# EAGLE design ODR_override rev 1a (EAGLE 7.5.0)
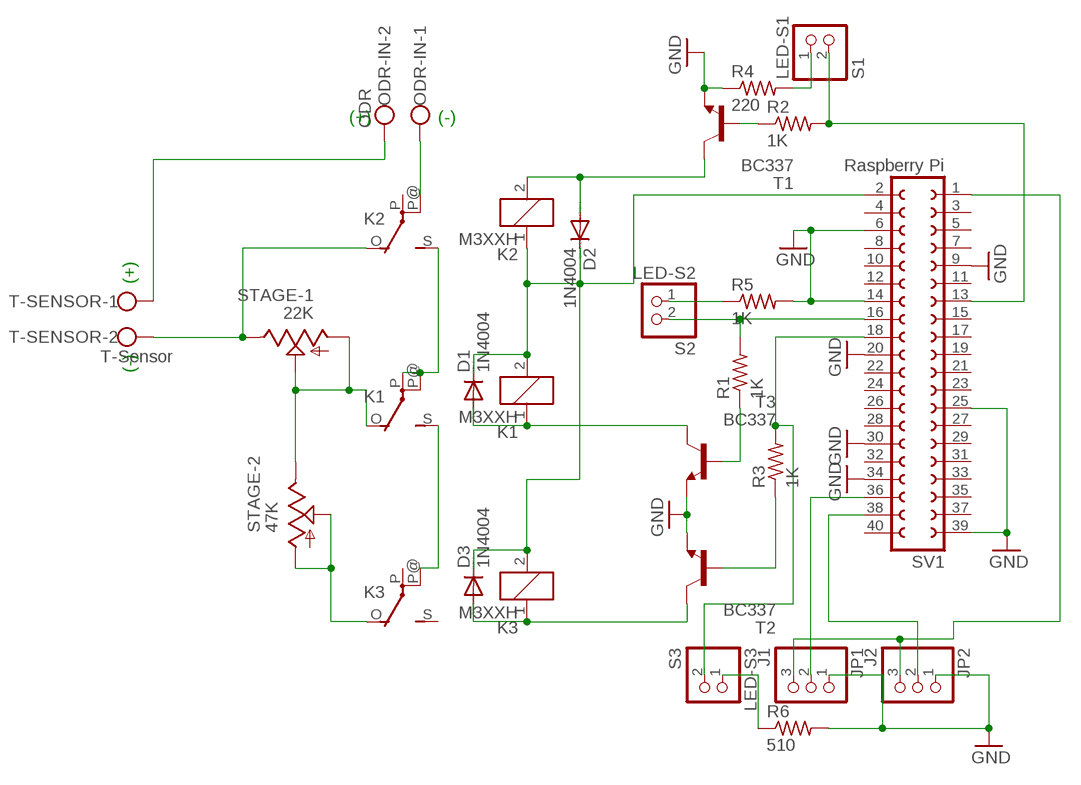
[diagram p0: schematic, sheet 1]

## Parts
D1  1N4004  [DO41-10]
D2  1N4004  [DO41-10]
D3  1N4004  [DO41-10]
JP1  J1  PINHD-1X3  [1X03]
JP2  J2  PINHD-1X3  [1X03]
K1  M3XXH  [M3XXH]
K2  M3XXH  [M3XXH]
K3  M3XXH  [M3XXH]
LED-S1  S1  PINHD-1X2  [1X02]
LED-S2  S2  PINHD-1X2  [1X02]
LED-S3  S3  PINHD-1X2  [1X02]
ODR-IN  ODR  W237-102  [W237-102]
R1  1K  R-US_0204/7  [0204/7]
R2  1K  R-US_0204/7  [0204/7]
R3  1K  R-US_0204/7  [0204/7]
R4  220  R-US_0204/7  [0204/7]
R5  1K  R-US_0204/7  [0204/7]
R6  510  R-US_0204/7  [0204/7]
STAGE-1  22K  TRIM_US-B25P  [B25P]
STAGE-2  47K  TRIM_US-B25P  [B25P]
SV1  Raspberry Pi  FE20-2  [FE20-2]
T1  BC337  [TO92]
T2  BC337  [TO92]
T3  BC337  [TO92]
T-SENSOR  T-Sensor  W237-102  [W237-102]

## Nets
GND: JP1.1 JP2.1 R4.1 R5.2 R6.2 SV1.6 SV1.9 SV1.14 SV1.20 SV1.25 SV1.30 SV1.34 SV1.39 T1.1(E) T2.1(E) T3.1(E)
N$1: D1.A K1.1 T3.3(C)
N$2: LED-S1.2 R2.2 SV1.13
N$3: K1.S(2:S) K3.P@(2:P)
N$4: K2.P@(2:P) ODR-IN.1
N$5: LED-S3.2 R3.2 SV1.18
N$6: D3.A K3.1 T2.3(C)
N$7: ODR-IN.2 T-SENSOR.1
N$8: K1.O(2:O) STAGE-1.A STAGE-1.S STAGE-2.E
N$9: D2.A K2.2 T1.3(C)
N$10: R2.1 T1.2(B)
N$11: JP1.3 JP2.3 SV1.1
N$12: LED-S2.2 R1.2 SV1.16
N$13: R3.1 T2.2(B)
N$14: R1.1 T3.2(B)
N$15: K2.O(2:O) STAGE-1.E T-SENSOR.2
N$16: K1.P(2:P) K1.P@(2:P) K2.S(2:S)
N$17: K3.O(2:O) STAGE-2.A STAGE-2.S
N$18: JP1.2 SV1.36
N$19: JP2.2 SV1.38
N$20: LED-S1.1 R4.2
N$21: LED-S2.1 R5.1
N$22: LED-S3.1 R6.1
VCC: D1.C D2.C D3.C K1.2 K2.1 K3.2 SV1.2
Unconnected: K2.P(2:P) K3.P(2:P) K3.S(2:S) SV1.3 SV1.4 SV1.5 SV1.7 SV1.8 SV1.10 SV1.11 SV1.12 SV1.15 SV1.17 SV1.19 SV1.21 SV1.22 SV1.23 SV1.24 SV1.26 SV1.27 SV1.28 SV1.29 SV1.31 SV1.32 SV1.33 SV1.35 SV1.37 SV1.40

## Notes on the sheet
- (+) | (-)
- (+)
- (-)

## Library data of the parts
D1-D3 = diode:1N4004: DIODE general purpose rectifier, 1 A
JP1 JP2 = pinhead:PINHD-1X3: PIN HEADER
K1-K3 = relay:M3XXH: RELAY 1 x switch; OC_FARNELL: unknown; OC_NEWARK: unknown
LED-S1-LED-S3 = pinhead:PINHD-1X2: PIN HEADER
ODR-IN T-SENSOR = con-wago-500:W237-102: WAGO SCREW CLAMP; MPN: 237-102; OC_FARNELL: unknown; OC_NEWARK: 70K9898
R1-R6 = resistor:R-US_: RESISTOR, American symbol
STAGE-1 STAGE-2 = pot:TRIM_US-: POTENTIOMETER
SV1 = con-lsta:FE20-2: FEMALE HEADER; OC_FARNELL: unknown; OC_NEWARK: unknown
T1-T3 = transistor:BC337: NPN TRANSISTOR

## Board
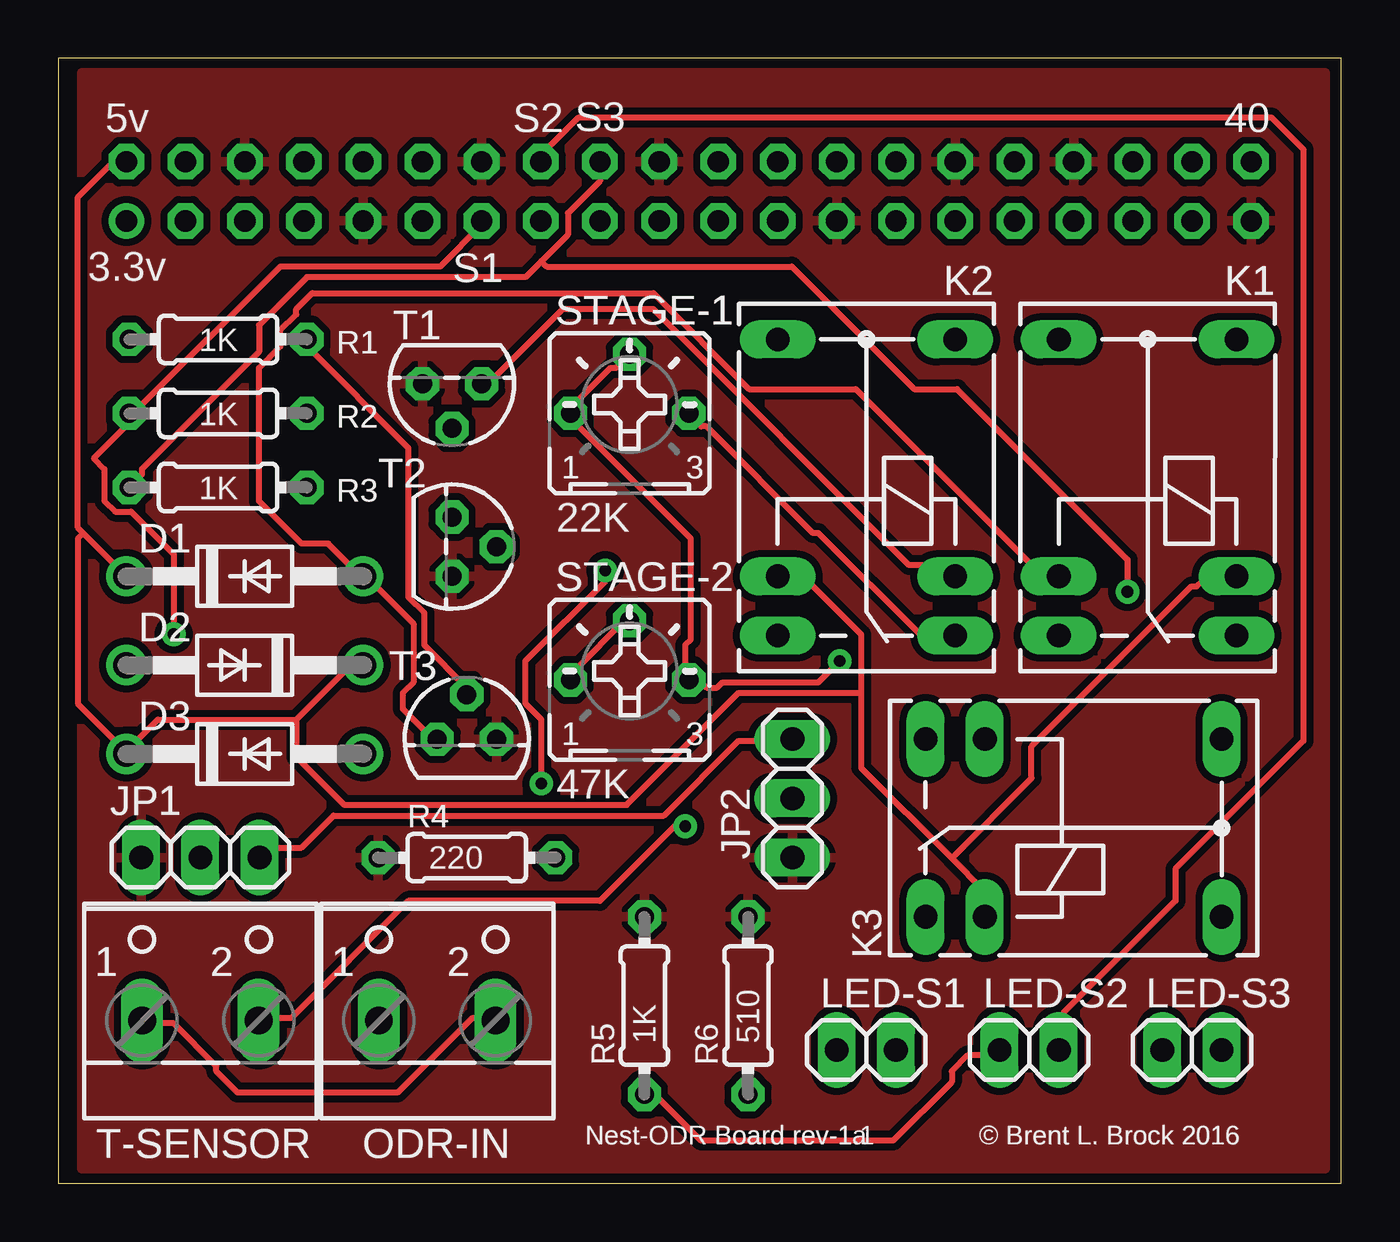
[diagram p1: board, top side]
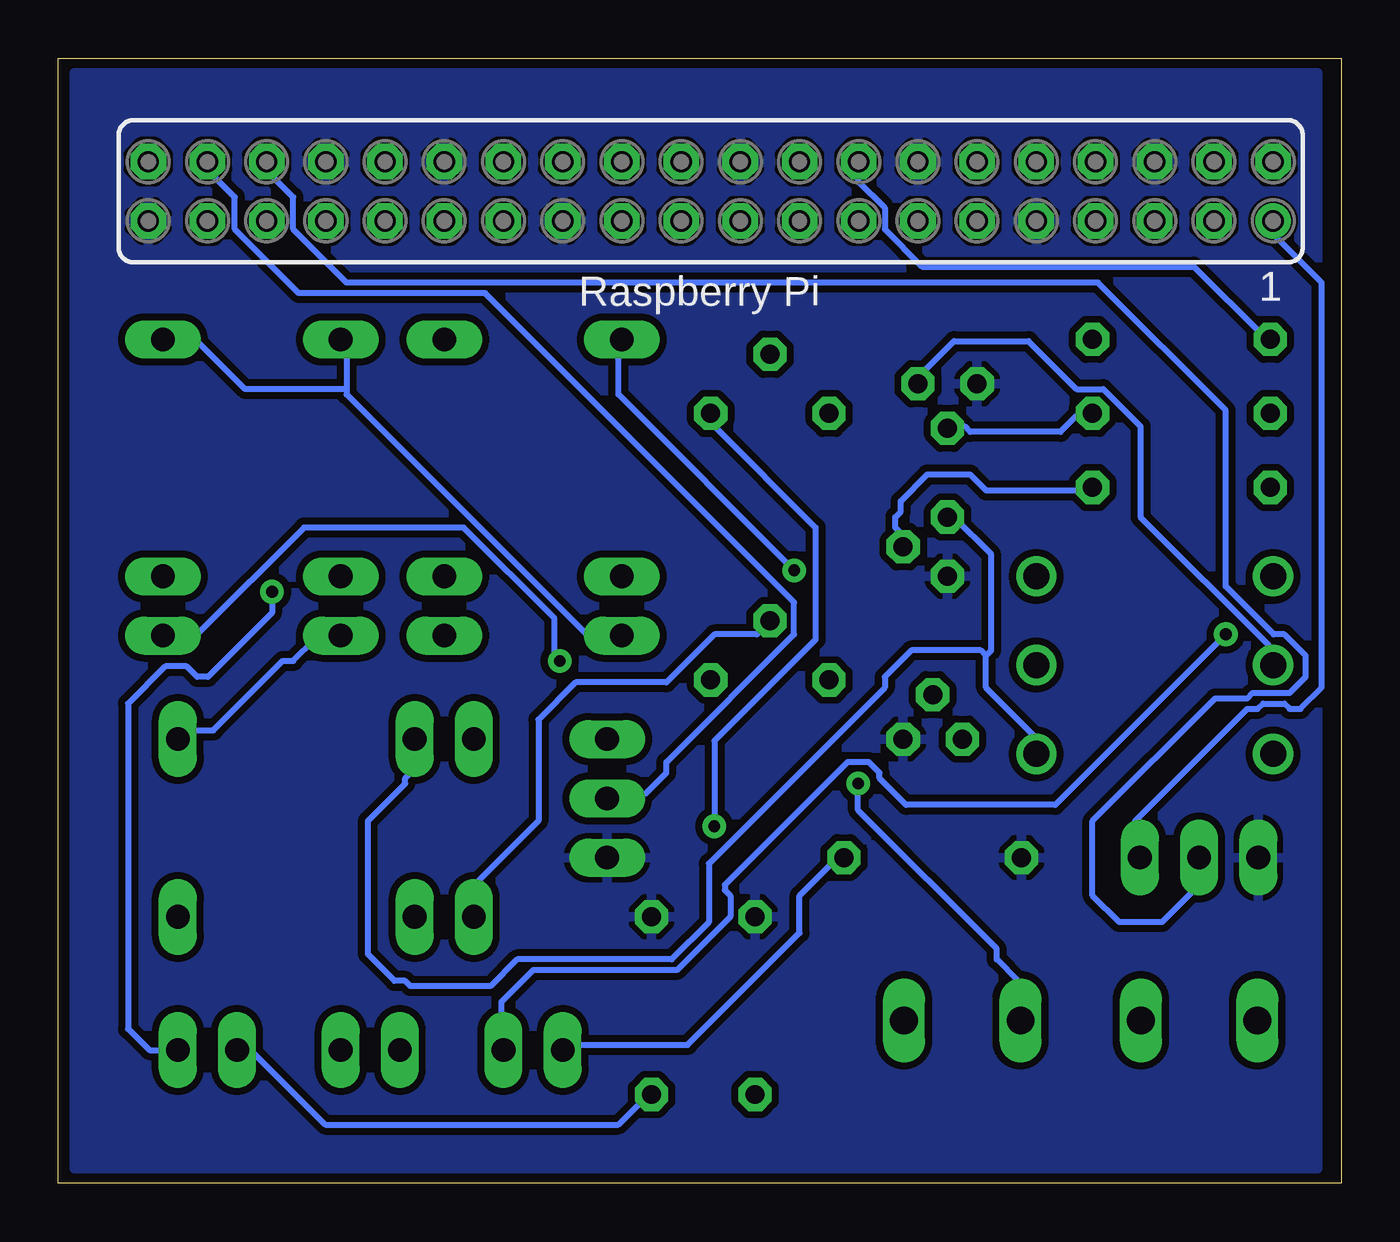
[diagram p2: board, bottom side, seen from below]

Size 55.04 x 48.25 mm. Coordinates in mm from the lower left corner, seen from the top.
Outline: 0,0 55.04,0 55.04,48.25 0,48.25 0,0
Copper layers (1*16): Top 0.035mm / dielectric 1.5mm / Bottom 0.035mm
Design rules "SparkFun *": minimum track width 10mil, minimum drill 20mil, track to track 8mil, track to pad 8mil, pad to pad 8mil, via to via 8mil, smd to smd 8mil, copper to edge 10mil, drill to drill 8mil, minimum pad ring 12mil, minimum via ring 10mil, stop-mask expansion 4mil, vias tented up to drill 25mil, thermal gap 10mil

### Footprints (pad centres in the part's own frame; a part is rotated, then mirrored left to right if it is on the bottom)
DO41-10 = drill 1.118: A 5.08,0; C -5.08,0
1X03 = drill 1.016 long: 1 -2.54,0; 2 0,0; 3 2.54,0
M3XXH = drill 1.016 long: 1 -3.81,3.81; 2 -3.81,-3.81; O -6.35,-3.81; P 6.35,-3.81; P@ 6.35,3.81; S -6.35,3.81
1X02 = drill 1.016 long: 1 -1.27,0; 2 1.27,0
W237-102 = drill 1.194 long: 1 -2.5,-1.27; 2 2.5,-1.27
0204/7 = drill 0.813 octagon: 1 -3.81,0; 2 3.81,0
B25P = drill 0.813 octagon: A -2.54,0; E 2.54,0; S 0,2.54
FE20-2 = drill 0.914: 1 -24.13,1.27 | drill 0.914 octagon: 2 -24.13,-1.27; 3 -21.59,1.27; 4 -21.59,-1.27; 5 -19.05,1.27; 6 -19.05,-1.27; 7 -16.51,1.27; 8 -16.51,-1.27; 9 -13.97,1.27; 10 -13.97,-1.27; 11 -11.43,1.27; 12 -11.43,-1.27; 13 -8.89,1.27; 14 -8.89,-1.27; 15 -6.35,1.27; 16 -6.35,-1.27; 17 -3.81,1.27; 18 -3.81,-1.27; 19 -1.27,1.27; 20 -1.27,-1.27; 21 1.27,1.27; 22 1.27,-1.27; 23 3.81,1.27; 24 3.81,-1.27; 25 6.35,1.27; 26 6.35,-1.27; 27 8.89,1.27; 28 8.89,-1.27; 29 11.43,1.27; 30 11.43,-1.27; 31 13.97,1.27; 32 13.97,-1.27; 33 16.51,1.27; 34 16.51,-1.27; 35 19.05,1.27; 36 19.05,-1.27; 37 21.59,1.27; 38 21.59,-1.27; 39 24.13,1.27; 40 24.13,-1.27
TO92 = drill 0.813 octagon: 1 1.27,0; 2 0,1.905; 3 -1.27,0

### Placement (x,y rotation side)
D1  8,26.04 0 top
D2  8,22.23 180 top
D3  8,18.41 0 top
JP1  6.1,13.97 0 top
JP2  31.5,16.51 90 top
K1  46.74,29.84 90 top
K2  34.67,29.84 90 top
K3  43.56,15.24 0 top
LED-S1  34.67,5.71 0 top
LED-S2  41.66,5.71 0 top
LED-S3  48.64,5.71 0 top
ODR-IN  16.26,8.26 0 top
R1  6.86,36.2 180 top
R2  6.86,33.02 180 top
R3  6.86,29.84 180 top
R4  17.53,13.97 0 top
R5  25.15,7.62 90 top
R6  29.59,7.62 90 top
STAGE-1  24.51,33.02 0 top
STAGE-2  24.51,21.59 0 top
SV1  27.05,42.55 180 bottom
T1  16.89,34.29 180 top
T2  16.89,27.3 270 top
T3  17.53,19.05 0 top
T-SENSOR  6.1,8.26 0 top

### Tracks (layer width: path | path; a pad name or v marks a point on that pad's centre or on a via)
GND
  pour Top (isolate 0.305): 1.02,47.62 1.02,0.64 54.36,0.64 54.36,47.62
  pour Bottom (isolate 0.305): 1.02,47.62 1.02,0.64 54.36,0.64 54.36,47.62
N$1
  Top 0.254: T3.3 16.15,19.2 15.93,19.2 14.78,20.34 14.78,21.03 15.24,21.49 15.24,24 13.18,26.06 D1.A 12.95,26.06 11.58,27.43 10.44,27.43 8.61,29.26 8.61,34.98 9.53,35.89 9.53,36.58 10.21,37.26 10.21,37.49 10.9,38.18 25.53,38.18 29.64,34.06 34.21,34.06 42.22,26.06 42.9,26.06 K1.1
N$2  (via drill 0.51)
  Top 0.254: SV1.13 18.21,41.15 16.38,39.32 9.53,39.32 3.35,33.15 3.12,33.15 R2.2 2.9,32.92 2.9,32.46 1.52,31.09 1.98,30.63 1.98,29.26 2.44,28.8 3.12,28.8 4.95,26.98 v4.95,23.55
  Bottom 0.254: v4.95,23.55 12.27,16.23 18.67,16.23 19.81,17.37 19.81,17.6 20.27,18.06 21.18,18.06 26.44,12.8 26.44,12.57 26.21,12.34 26.21,11.43 28.5,9.14 34.67,9.14 36.04,7.77 36.04,5.71 LED-S1.2
N$3
  Bottom 0.254: K3.P@ 49.53,19.43 48.39,19.43 45.41,22.4 44.96,22.4 44.04,23.32 43.13,23.32 K1.S
N$4  (via drill 0.51)
  Top 0.254: v23.47,26.29 23.47,25.83 20.04,22.4 20.04,20.57 20.73,19.89 v20.73,17.14
  Bottom 0.254: v23.47,26.29 31.01,33.83 31.01,36.12 K2.P@ | v20.73,17.14 20.73,16 14.78,10.06 14.78,9.6 13.87,8.69 13.87,7.09 ODR-IN.1
N$5  (via drill 0.51)
  Top 0.254: 20.73,39.55 21.87,40.69 21.87,41.6 23.24,42.98 SV1.18 | 20.73,39.55 20.04,38.86 10.67,38.86 8.61,36.8 8.61,35.66 3.58,30.63 3.58,30.4 3.12,29.95 R3.2 | v45.87,25.38 45.87,26.75 38.56,34.06 36.73,34.06 31.47,39.32 20.95,39.32 20.73,39.55
  Bottom 0.254: LED-S3.2 51.13,5.71 52.05,6.63 52.05,20.57 50.44,22.17 49.53,22.17 49.07,21.72 48.62,21.72 45.87,24.46 v45.87,25.38
N$6
  Bottom 0.254: T2.3 16.61,28.57 15.01,26.98 15.01,22.86 15.24,22.63 | 15.24,22.63 15.24,21.26 13.18,19.2 13.18,18.52 D3.A | 15.24,22.63 15.47,22.86 18.44,22.86 19.58,21.72 19.58,21.26 27.13,13.72 27.13,11.2 28.73,9.6 35.36,9.6 36.5,8.46 39.93,8.46 40.16,8.69 40.62,8.69 41.76,9.83 41.76,15.54 40.16,17.14 40.16,17.37 39.93,17.6 39.93,18.97 K3.1
N$7
  Top 0.254: T-SENSOR.1 3.81,6.86 4.95,6.86 6.78,5.03 6.78,4.8 7.7,3.89 14.55,3.89 17.75,7.09 18.67,7.09 ODR-IN.2
N$8  (via drill 0.51)
  Top 0.254: STAGE-1.S 23.93,34.98 23.7,34.98 21.87,33.15 STAGE-1.A 21.87,32.92 27.13,27.66 27.13,23.32 26.9,23.09 26.9,21.72 STAGE-2.E 27.13,21.49 27.58,21.49 27.81,21.26 28.27,21.26 28.5,21.49 32.61,21.49 v33.53,22.4
  Bottom 0.254: v33.53,22.4 33.76,22.63 33.76,24.23 37.64,28.12 44.5,28.12 49.07,23.55 50.44,23.55 K1.O
N$9
  Top 0.254: T1.3 18.44,34.29 21.64,37.49 25.53,37.49 36.5,26.52 37.87,26.52 38.33,26.06 K2.2
  Bottom 0.254: D2.A 3.12,22.4 3.12,23.09 8.61,28.57 8.61,32.46 10.21,34.06 11.35,34.06 13.41,36.12 16.61,36.12 17.98,34.75 17.98,34.29 T1.3
N$10
  Bottom 0.254: T1.2 16.84,32.46 16.15,32.46 15.93,32.23 12.04,32.23 11.35,32.92 10.67,32.92 R2.1
N$11
  Top 0.254: JP1.3 9.07,14.4 10.44,14.4 11.81,15.77 25.98,15.77 29.18,18.97 31.47,18.97 JP2.3
  Bottom 0.254: SV1.1 2.9,41.15 2.9,40.69 0.84,38.63 0.84,21.26 1.75,20.34 2.21,20.34 2.44,20.57 3.35,20.57 3.58,20.34 4.04,20.34 8.84,15.54 8.84,14.17 JP1.3
N$12
  Top 0.254: LED-S2.2 43.13,5.71 43.13,7.32 47.93,12.12 47.93,13.49 53.42,18.97 53.42,44.35 52.05,45.72 22.33,45.72 20.5,43.89 SV1.16
  Bottom 0.254: R1.2 3.12,36.35 3.35,36.35 6.33,39.32 17.98,39.32 19.58,40.92 19.58,41.83 20.73,42.98 20.73,43.66 SV1.16
N$13
  Bottom 0.254: R3.1 10.67,29.72 15.24,29.72 15.93,30.4 17.75,30.4 18.9,29.26 18.9,28.8 19.13,28.57 19.13,28.12 18.9,27.89 18.9,27.43 T2.2
N$14
  Top 0.254: T3.2 17.53,21.26 15.7,23.09 15.7,24.46 15.01,25.15 15.01,31.55 10.67,35.89 R1.1
N$15  (via drill 0.51)
  Top 0.254: STAGE-1.E 27.13,32.92 27.58,32.46 27.81,32.46 32.38,27.89 32.61,27.89 36.96,23.55 38.33,23.55 K2.O | v26.9,15.32 26.44,15.32 23.24,12.12 15.01,12.12 9.98,7.09 8.61,7.09 T-SENSOR.2
  Bottom 0.254: v26.9,15.32 26.9,18.97 22.55,23.32 22.55,28.12 26.9,32.46 26.9,32.92 STAGE-1.E
N$16
  Bottom 0.254: 42.67,34.06 42.67,35.89 42.9,36.12 K1.P@ | 42.67,34.06 42.67,33.83 32.38,23.55 31.01,23.55 K2.S | 42.67,34.06 47.02,34.06 49.07,36.12 50.44,36.12 K1.P
N$17
  Top 0.254: STAGE-2.A 22.1,21.72 22.1,21.95 24.38,24.23 STAGE-2.S
  Bottom 0.254: K3.O 37.19,11.43 37.19,12.8 34.44,15.54 34.44,19.89 32.84,21.49 28.96,21.49 26.9,23.55 25.07,23.55 24.61,24 STAGE-2.S
N$18
  Bottom 0.254: SV1.36 46.1,43.43 44.96,42.29 44.96,40.92 42.67,38.63 10.44,38.63 4.95,33.15 4.95,25.6 2.9,23.55 2.44,23.55 1.52,22.63 1.52,21.72 2.21,21.03 3.81,21.03 4.04,20.8 5.41,20.8 10.67,15.54 10.67,12.34 9.53,11.2 7.7,11.2 6.1,12.8 JP1.2
N$19
  Bottom 0.254: SV1.38 48.62,43.66 48.62,43.43 47.47,42.29 47.47,40.92 44.73,38.18 36.73,38.18 23.47,24.92 23.47,23.55 28.96,18.06 28.96,17.6 29.87,16.69 31.47,16.69 JP2.2
N$20
  Bottom 0.254: R4.2 21.41,13.95 21.64,13.95 23.24,12.34 23.24,10.74 28.04,5.94 33.07,5.94 33.3,5.71 LED-S1.1
N$21
  Top 0.254: LED-S2.1 40.16,5.49 39.01,5.49 38.33,4.8 38.33,4.34 35.81,1.83 27.58,1.83 25.76,3.66 25.3,3.66 R5.1
N$22
  Bottom 0.254: LED-S3.1 46.79,5.71 43.59,2.52 31.01,2.52 29.87,3.66 29.64,3.66 R6.1
VCC
  Top 0.254: 38.33,13.95 34.44,17.83 34.44,21.03 | 38.33,13.95 39.7,12.57 39.7,11.43 K3.2 | 34.44,21.03 34.44,23.55 32.16,25.83 31.01,25.83 K2.1 | 38.33,13.95 41.76,17.37 41.76,18.75 48.62,25.6 48.84,25.6 49.07,25.83 50.44,25.83 K1.2 | D1.C 1.07,27.89 | 1.07,27.89 0.84,28.12 0.84,42.29 2.21,43.66 2.9,43.66 SV1.2 | 2.9,18.52 0.84,20.57 0.84,27.66 1.07,27.89 | 10.21,19.89 12.5,22.17 12.95,22.17 D2.C | 10.21,19.89 4.27,19.89 2.9,18.52 | 2.9,18.52 D3.C | 34.44,21.03 29.18,21.03 24.38,16.23 12.27,16.23 10.21,18.29 10.21,19.89

### Text on the board
tNames: Nest-ODR Board rev-1a | © Brent L. Brock 2016
_tsilk: 5v | S2 | S3 | 40 | 3.3v | S1 | K2 | K1 | 1K | STAGE-1 | R1 | T1 | 1K | R2 | 1K | T2 | 1 | 3 | R3 | 22K | D1 | STAGE-2 | D2 | T3 | D3 | 1 | 3 | 47K | JP1 | R4 | JP2 | 220 | K3 | 1 | 2 | 1 | 2 | LED-S1 | LED-S2 | LED-S3 | 1K | 510 | R5 | R6 | Nest-ODR Board rev-1.1 | © Brent L. Brock 2016 | T-SENSOR | ODR-IN
_bsilk: Raspberry Pi
203bmp: C:/Users/bbrock/Documents/HoloScene/logo-final-3color.bmp